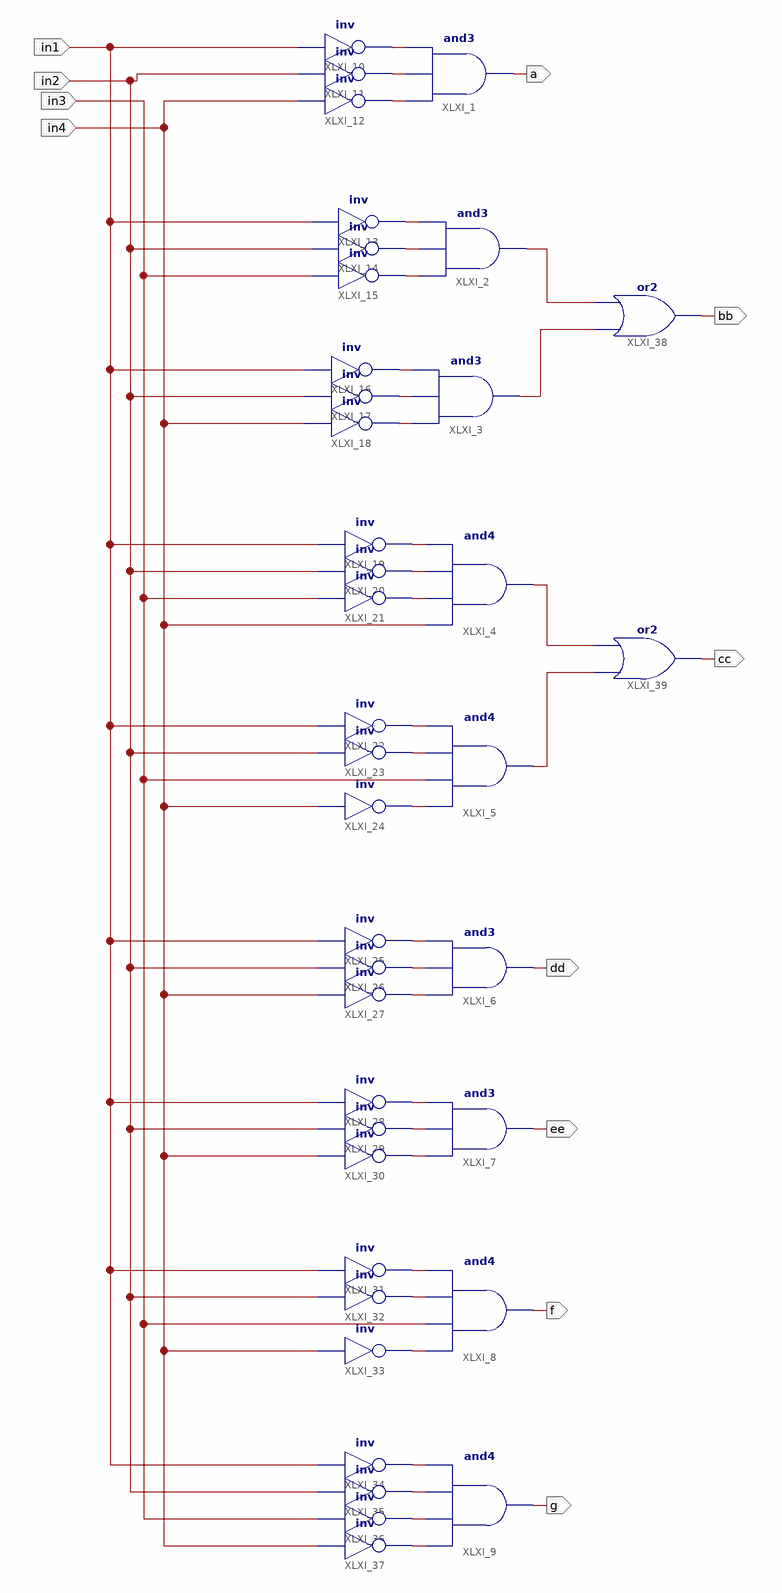
[diagram p0: schematic sheet 1]
// Xilinx ISE schematic Decoderto7segment3.sch (spartan6) as structural Verilog: 39 symbols, 11 ports
module Decoderto7segment3 (
  input  in1,
  input  in2,
  input  in3,
  input  in4,
  output a,
  output ee,
  output f,
  output g,
  output bb,
  output cc,
  output dd
);

  wire b, c, d, e, XLXN_1, XLXN_2, XLXN_3, XLXN_4, XLXN_5, XLXN_6, XLXN_7, XLXN_8, XLXN_9, XLXN_10, XLXN_11,
       XLXN_12, XLXN_13, XLXN_14, XLXN_15, XLXN_16, XLXN_17, XLXN_18, XLXN_19, XLXN_20, XLXN_21, XLXN_22,
       XLXN_23, XLXN_24, XLXN_25, XLXN_26, XLXN_27, XLXN_28;

  and XLXI_1 (a, XLXN_3, XLXN_2, XLXN_1);
  and XLXI_2 (b, XLXN_6, XLXN_5, XLXN_4);
  and XLXI_3 (c, XLXN_9, XLXN_8, XLXN_7);
  and XLXI_4 (d, in4, XLXN_12, XLXN_11, XLXN_10);
  and XLXI_5 (e, XLXN_15, in3, XLXN_14, XLXN_13);
  and XLXI_6 (dd, XLXN_18, XLXN_17, XLXN_16);
  and XLXI_7 (ee, XLXN_21, XLXN_20, XLXN_19);
  and XLXI_8 (f, XLXN_24, in3, XLXN_23, XLXN_22);
  and XLXI_9 (g, XLXN_28, XLXN_27, XLXN_26, XLXN_25);
  not XLXI_10 (XLXN_1, in1);
  not XLXI_11 (XLXN_2, in2);
  not XLXI_12 (XLXN_3, in4);
  not XLXI_13 (XLXN_4, in1);
  not XLXI_14 (XLXN_5, in2);
  not XLXI_15 (XLXN_6, in3);
  not XLXI_16 (XLXN_7, in1);
  not XLXI_17 (XLXN_8, in2);
  not XLXI_18 (XLXN_9, in4);
  not XLXI_19 (XLXN_10, in1);
  not XLXI_20 (XLXN_11, in2);
  not XLXI_21 (XLXN_12, in3);
  not XLXI_22 (XLXN_13, in1);
  not XLXI_23 (XLXN_14, in2);
  not XLXI_24 (XLXN_15, in4);
  not XLXI_25 (XLXN_16, in1);
  not XLXI_26 (XLXN_17, in2);
  not XLXI_27 (XLXN_18, in4);
  not XLXI_28 (XLXN_19, in1);
  not XLXI_29 (XLXN_20, in2);
  not XLXI_30 (XLXN_21, in4);
  not XLXI_31 (XLXN_22, in1);
  not XLXI_32 (XLXN_23, in2);
  not XLXI_33 (XLXN_24, in4);
  not XLXI_34 (XLXN_25, in1);
  not XLXI_35 (XLXN_26, in2);
  not XLXI_36 (XLXN_27, in3);
  not XLXI_37 (XLXN_28, in4);
  or XLXI_38 (bb, c, b);
  or XLXI_39 (cc, e, d);
endmodule
